# EAGLE design RAMASUK cekiwiw (EAGLE 9.6.2)
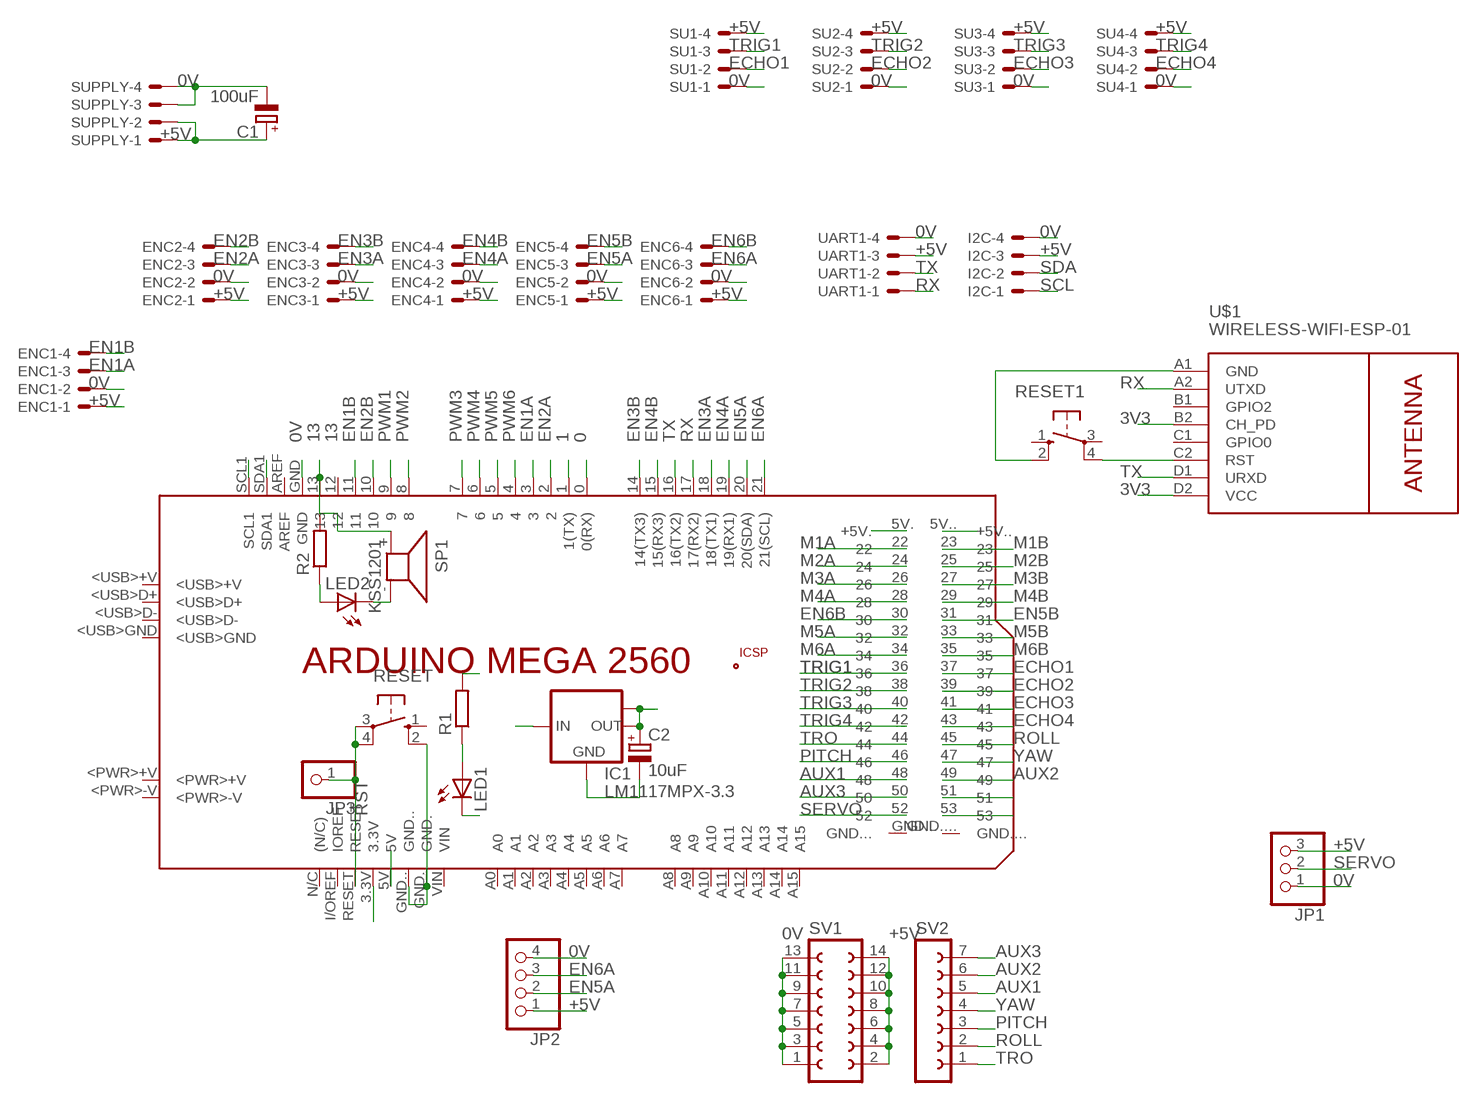
[diagram p0: schematic, sheet 1, part 1 of 2]
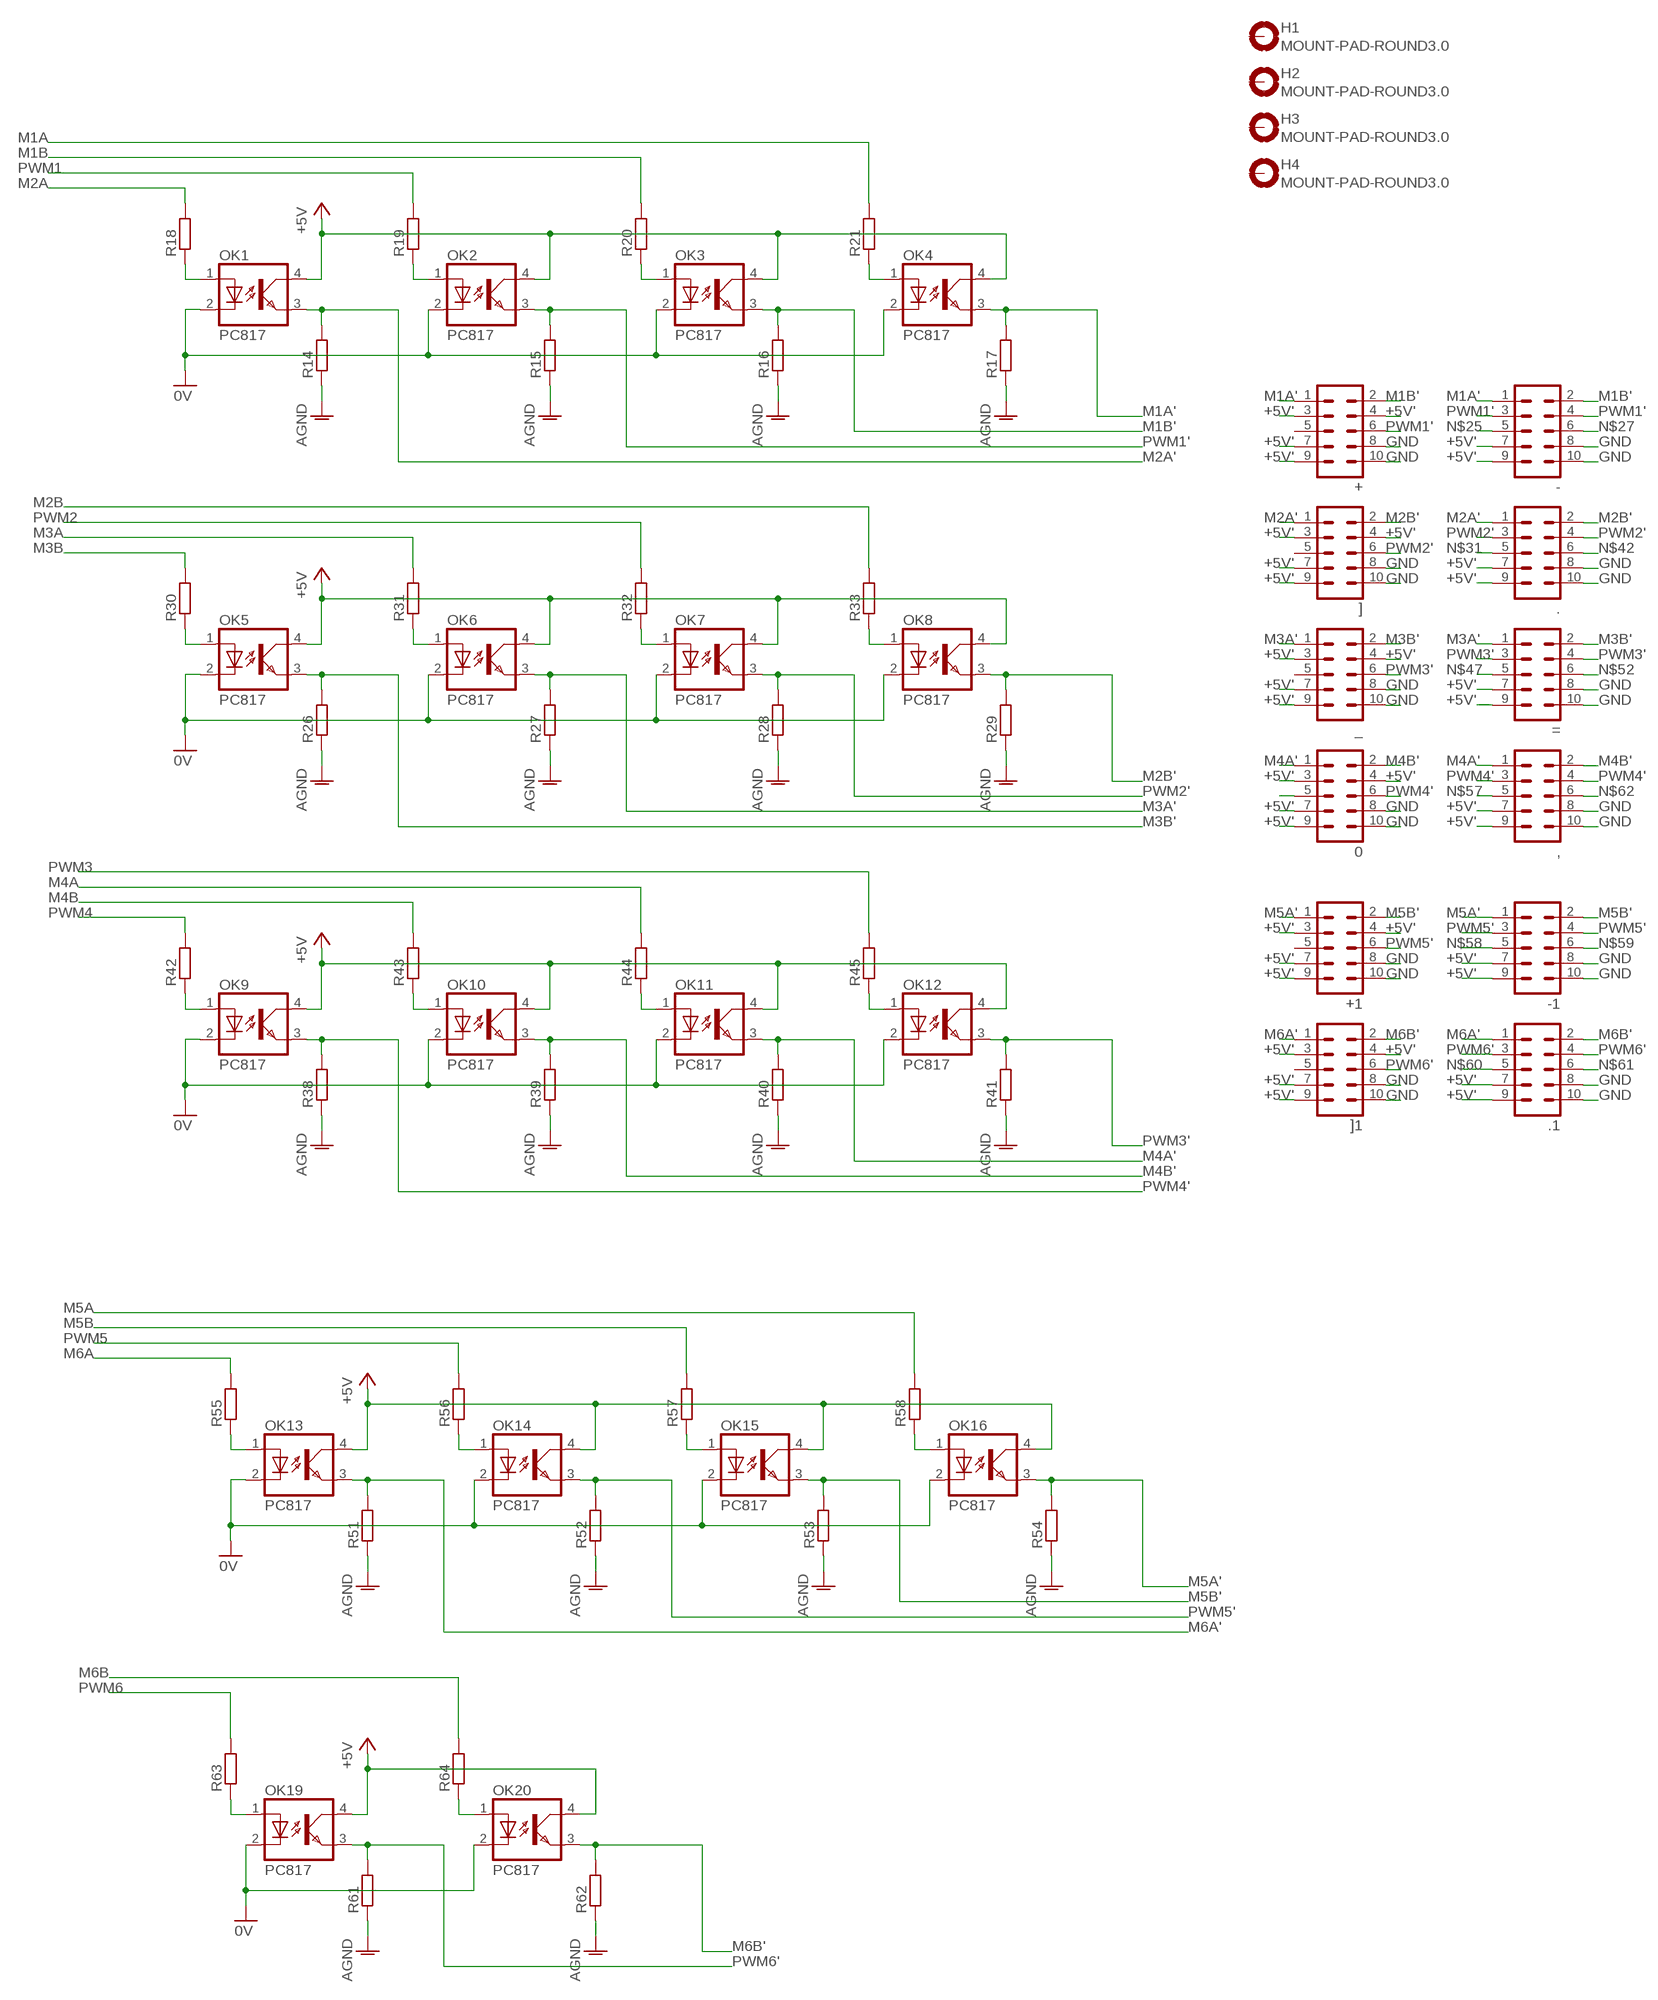
[diagram p1: schematic, sheet 1, part 2 of 2]

## Parts
0  ML10  [ML10]
+  ML10  [ML10]
+1  ML10  [ML10]
,  ML10  [ML10]
-  ML10  [ML10]
-1  ML10  [ML10]
.  ML10  [ML10]
.1  ML10  [ML10]
=  ML10  [ML10]
]  ML10  [ML10]
]1  ML10  [ML10]
_  ML10  [ML10]
C1  100uF  CPOL-EUE2.5-5  [E2,5-5]
C2  10uF  CPOL-EUE2.5-5  [E2,5-5]
ENC1  22-23-2041  [22-23-2041]
ENC2  22-23-2041  [22-23-2041]
ENC3  22-23-2041  [22-23-2041]
ENC4  22-23-2041  [22-23-2041]
ENC5  22-23-2041  [22-23-2041]
ENC6  22-23-2041  [22-23-2041]
H1  MOUNT-PAD-ROUND3.0  [3,0-PAD]
H2  MOUNT-PAD-ROUND3.0  [3,0-PAD]
H3  MOUNT-PAD-ROUND3.0  [3,0-PAD]
H4  MOUNT-PAD-ROUND3.0  [3,0-PAD]
I2C  22-23-2041  [22-23-2041]
IC1  LM1117MPX-3.3  [SOT223]
JP1  PINHD-1X3  [1X03]
JP2  PINHD-1X4  [1X04]
JP3  PINHD-1X1  [1X01]
LED1  LED3MM  [LED3MM]
LED2  LED3MM  [LED3MM]
OK1  PC817  [DIL04]
OK2  PC817  [DIL04]
OK3  PC817  [DIL04]
OK4  PC817  [DIL04]
OK5  PC817  [DIL04]
OK6  PC817  [DIL04]
OK7  PC817  [DIL04]
OK8  PC817  [DIL04]
OK9  PC817  [DIL04]
OK10  PC817  [DIL04]
OK11  PC817  [DIL04]
OK12  PC817  [DIL04]
OK13  PC817  [DIL04]
OK14  PC817  [DIL04]
OK15  PC817  [DIL04]
OK16  PC817  [DIL04]
OK19  PC817  [DIL04]
OK20  PC817  [DIL04]
PCB1  ARDUINO_MEGA2560  [ARDUINO_MEGA2560]
R1  R-EU_M0805  [M0805]
R2  R-EU_M0805  [M0805]
R14  R-EU_M0805  [M0805]
R15  R-EU_M0805  [M0805]
R16  R-EU_M0805  [M0805]
R17  R-EU_M0805  [M0805]
R18  R-EU_M0805  [M0805]
R19  R-EU_M0805  [M0805]
R20  R-EU_M0805  [M0805]
R21  R-EU_M0805  [M0805]
R26  R-EU_M0805  [M0805]
R27  R-EU_M0805  [M0805]
R28  R-EU_M0805  [M0805]
R29  R-EU_M0805  [M0805]
R30  R-EU_M0805  [M0805]
R31  R-EU_M0805  [M0805]
R32  R-EU_M0805  [M0805]
R33  R-EU_M0805  [M0805]
R38  R-EU_M0805  [M0805]
R39  R-EU_M0805  [M0805]
R40  R-EU_M0805  [M0805]
R41  R-EU_M0805  [M0805]
R42  R-EU_M0805  [M0805]
R43  R-EU_M0805  [M0805]
R44  R-EU_M0805  [M0805]
R45  R-EU_M0805  [M0805]
R51  R-EU_M0805  [M0805]
R52  R-EU_M0805  [M0805]
R53  R-EU_M0805  [M0805]
R54  R-EU_M0805  [M0805]
R55  R-EU_M0805  [M0805]
R56  R-EU_M0805  [M0805]
R57  R-EU_M0805  [M0805]
R58  R-EU_M0805  [M0805]
R61  R-EU_M0805  [M0805]
R62  R-EU_M0805  [M0805]
R63  R-EU_M0805  [M0805]
R64  R-EU_M0805  [M0805]
RESET  40-XX  [B3F-40XX]
RESET1  40-XX  [B3F-40XX]
SP1  KSS1201  [KSS1201]
SU1  22-23-2041  [22-23-2041]
SU2  22-23-2041  [22-23-2041]
SU3  22-23-2041  [22-23-2041]
SU4  22-23-2041  [22-23-2041]
SUPPLY  22-23-2041  [22-23-2041]
SV1  FE07-2  [FE07-2]
SV2  FE07-1  [FE07]
U$1  WIRELESS-WIFI-ESP-01  [WIRELESS-WIFI-ESP-01]
UART1  22-23-2041  [22-23-2041]

## Nets
0: PCB1.0(0(RX))
0V: C1.- ENC1.2 ENC2.2 ENC3.2 ENC4.2 ENC5.2 ENC6.2 I2C.4 JP1.1 JP2.4 LED1.K(C) LED2.K(C) OK1.2(C) OK2.2(C) OK3.2(C) OK4.2(C) OK5.2(C) OK6.2(C) OK7.2(C) OK8.2(C) OK9.2(C) OK10.2(C) OK11.2(C) OK12.2(C) OK13.2(C) OK14.2(C) OK15.2(C) OK16.2(C) OK19.2(C) OK20.2(C) PCB1.GND PCB1.GND. PCB1.GND.. RESET.2(S1) SP1.- SU1.1 SU2.1 SU3.1 SU4.1 SUPPLY.3 SUPPLY.4 SV1.1 SV1.3 SV1.5 SV1.7 SV1.9 SV1.11 SV1.13 UART1.4
1: PCB1.1(1(TX))
3V3: C2.+ IC1.2(OUT) IC1.TAB(OUT1) PCB1.3.3V U$1.B2(CH_PD) U$1.D2(VCC)
13: PCB1.13 R2.2 SP1.+
+5V: C1.+ ENC1.1 ENC2.1 ENC3.1 ENC4.1 ENC5.1 ENC6.1 I2C.3 IC1.3(IN) JP1.3 JP2.1 PCB1.5V PCB1.5V.(+5V.) PCB1.5V..(+5V..) R1.2 SU1.4 SU2.4 SU3.4 SU4.4 SUPPLY.1 SUPPLY.2 SV1.2 SV1.4 SV1.6 SV1.8 SV1.10 SV1.12 SV1.14 UART1.3
+5V': 0.3 0.4 0.7 0.9 +1.3 +1.4 +1.7 +1.9 +.3 +.4 +.7 +.9 ,.7 ,.9 -1.7 -1.9 -.7 -.9 .1.7 .1.9 ..7 ..9 =.7 =.9 ]1.3 ]1.4 ]1.7 ]1.9 ].3 ].4 ].7 ].9 _.3 _.4 _.7 _.9 OK1.4(COL) OK2.4(COL) OK3.4(COL) OK4.4(COL) OK5.4(COL) OK6.4(COL) OK7.4(COL) OK8.4(COL) OK9.4(COL) OK10.4(COL) OK11.4(COL) OK12.4(COL) OK13.4(COL) OK14.4(COL) OK15.4(COL) OK16.4(COL) OK19.4(COL) OK20.4(COL) ; supply symbol labelled +5V
AUX1: PCB1.48 SV2.5
AUX2: PCB1.49 SV2.6
AUX3: PCB1.50 SV2.7
ECHO1: PCB1.37 SU1.2
ECHO2: PCB1.39 SU2.2
ECHO3: PCB1.41 SU3.2
ECHO4: PCB1.43 SU4.2
EN1A: ENC1.3 PCB1.3
EN1B: ENC1.4 PCB1.11
EN2A: ENC2.3 PCB1.2
EN2B: ENC2.4 PCB1.10
EN3A: ENC3.3 PCB1.18(18(TX1))
EN3B: ENC3.4 PCB1.14(14(TX3))
EN4A: ENC4.3 PCB1.19(19(RX1))
EN4B: ENC4.4 PCB1.15(15(RX3))
EN5A: ENC5.3 JP2.2 PCB1.20(20(SDA))
EN5B: ENC5.4 PCB1.31
EN6A: ENC6.3 JP2.3 PCB1.21(21(SCL))
EN6B: ENC6.4 PCB1.30
GND: 0.8 0.10 +1.8 +1.10 +.8 +.10 ,.8 ,.10 -1.8 -1.10 -.8 -.10 .1.8 .1.10 ..8 ..10 =.8 =.10 ]1.8 ]1.10 ].8 ].10 _.8 _.10 R14.1 R15.1 R16.1 R17.1 R26.1 R27.1 R28.1 R29.1 R38.1 R39.1 R40.1 R41.1 R51.1 R52.1 R53.1 R54.1 R61.1 R62.1 ; supply symbol labelled AGND
M1A: PCB1.22 R21.2
M1A': +.1 -.1 OK4.3(EMIT) R17.2
M1B: PCB1.23 R20.2
M1B': +.2 -.2 OK3.3(EMIT) R16.2
M2A: PCB1.24 R18.2
M2A': ..1 ].1 OK1.3(EMIT) R14.2
M2B: PCB1.25 R33.2
M2B': ..2 ].2 OK8.3(EMIT) R29.2
M3A: PCB1.26 R31.2
M3A': =.1 _.1 OK6.3(EMIT) R27.2
M3B: PCB1.27 R30.2
M3B': =.2 _.2 OK5.3(EMIT) R26.2
M4A: PCB1.28 R44.2
M4A': 0.1 ,.1 OK11.3(EMIT) R40.2
M4B: PCB1.29 R43.2
M4B': 0.2 ,.2 OK10.3(EMIT) R39.2
M5A: PCB1.32 R58.2
M5A': +1.1 -1.1 OK16.3(EMIT) R54.2
M5B: PCB1.33 R57.2
M5B': +1.2 -1.2 OK15.3(EMIT) R53.2
M6A: PCB1.34 R55.2
M6A': .1.1 ]1.1 OK13.3(EMIT) R51.2
M6B: PCB1.35 R64.2
M6B': .1.2 ]1.2 OK20.3(EMIT) R62.2
N$1: RESET1.2(S1) U$1.A1(GND)
N$3: LED1.A R1.1
N$4: LED2.A R2.1
N$6: C2.- IC1.1(GND)
N$9: OK1.1(A) R18.1
N$10: OK2.1(A) R19.1
N$11: OK3.1(A) R20.1
N$12: OK4.1(A) R21.1
N$13: RESET1.4(P1) U$1.C2(RST)
N$18: OK5.1(A) R30.1
N$19: OK6.1(A) R31.1
N$20: OK7.1(A) R32.1
N$21: OK8.1(A) R33.1
N$24: PCB1.51
N$25: -.5
N$26: PCB1.53
N$27: -.6
N$31: ..5
N$37: OK9.1(A) R42.1
N$38: OK10.1(A) R43.1
N$39: OK11.1(A) R44.1
N$40: OK12.1(A) R45.1
N$42: ..6
N$43: OK13.1(A) R55.1
N$44: OK14.1(A) R56.1
N$45: OK15.1(A) R57.1
N$46: OK16.1(A) R58.1
N$47: =.5
N$50: OK19.1(A) R63.1
N$51: OK20.1(A) R64.1
N$52: =.6
N$57: ,.5
N$58: -1.5
N$59: -1.6
N$60: .1.5
N$61: .1.6
N$62: ,.6
NC4: 0.5
PITCH: PCB1.46 SV2.3
PWM1: PCB1.9 R19.2
PWM1': +.6 -.3 -.4 OK2.3(EMIT) R15.2
PWM2: PCB1.8 R32.2
PWM2': ..3 ..4 ].6 OK7.3(EMIT) R28.2
PWM3: PCB1.7 R45.2
PWM3': =.3 =.4 _.6 OK12.3(EMIT) R41.2
PWM4: PCB1.6 R42.2
PWM4': 0.6 ,.3 ,.4 OK9.3(EMIT) R38.2
PWM5: PCB1.5 R56.2
PWM5': +1.6 -1.3 -1.4 OK14.3(EMIT) R52.2
PWM6: PCB1.4 R63.2
PWM6': .1.3 .1.4 ]1.6 OK19.3(EMIT) R61.2
ROLL: PCB1.45 SV2.2
RST: JP3.1 PCB1.RESET RESET.3(P) RESET.4(P1)
RX: PCB1.17(17(RX2)) U$1.A2(UTXD) UART1.1
SCL: I2C.1 PCB1.SCL1
SDA: I2C.2 PCB1.SDA1
SERVO: JP1.2 PCB1.52
TRIG1: PCB1.36 SU1.3
TRIG2: PCB1.38 SU2.3
TRIG3: PCB1.40 SU3.3
TRIG4: PCB1.42 SU4.3
TRO: PCB1.44 SV2.1
TX: PCB1.16(16(TX2)) U$1.D1(URXD) UART1.2
YAW: PCB1.47 SV2.4
Unconnected: +1.5 +.5 ]1.5 ].5 _.5 H1.B3,0(MOUNT) H2.B3,0(MOUNT) H3.B3,0(MOUNT) H4.B3,0(MOUNT) PCB1.12 PCB1.<PWR>+V PCB1.<PWR>-V PCB1.<USB>+V PCB1.<USB>D+ PCB1.<USB>D- PCB1.<USB>GND PCB1.A0 PCB1.A1 PCB1.A2 PCB1.A3 PCB1.A4 PCB1.A5 PCB1.A6 PCB1.A7 PCB1.A8 PCB1.A9 PCB1.A10 PCB1.A11 PCB1.A12 PCB1.A13 PCB1.A14 PCB1.A15 PCB1.AREF PCB1.GND... PCB1.GND.... PCB1.I/OREF(IOREF) PCB1.N/C((N/C)) PCB1.VIN RESET1.1(S) RESET1.3(P) RESET.1(S) U$1.B1(GPIO2) U$1.C1(GPIO0)

## Library data of the parts
0 + +1 , - -1 . .1 = ] ]1 _ = con-harting-ml:ML10: HARTING; OC_FARNELL: unknown; OC_NEWARK: unknown
C1 C2 = rcl:CPOL-EU: POLARIZED CAPACITOR, European symbol
ENC1-ENC6 I2C SU1-SU4 SUPPLY UART1 = con-molex:22-23-2041: .100" (2.54mm) Center Header - 4 Pin; MF: MOLEX; MPN: 22-23-2041; OC_FARNELL: 1462920; OC_NEWARK: 38C0355
H1-H4 = holes:MOUNT-PAD-ROUND: MOUNTING PAD, round
IC1 = lm1117:LM1117MPX-*
JP1 = adafruit:PINHD-1X3: PIN HEADER
JP2 = pinhead:PINHD-1X4: PIN HEADER
JP3 = pinhead:PINHD-1X1: PIN HEADER
LED1 LED2 = led:LED: LED OSRAM: - CHIPLED LG R971, LG N971, LY N971, LG Q971, LY Q971, LO R971, LY R971 LH N974, LH R974 LS Q976, LO Q976, LY Q976 LO Q996 - Hyper CHIPLED LW Q18S LB Q993, LB Q99A, LB R99A - SideLED LS A670, LO A670, LY A670, LG A670, LP A670 LB A673, LV A673, LT A673, LW A673 LH A674 LY A675 LS A676, LA A676, LO A676, LY A676, LW A676 LS A679, LY A679, LG A679 - Hyper Micro SIDELED® LS Y876, LA Y876, LO Y876, LY Y876 LT Y87S - SmartLED LW L88C, LW L88S LB L89C, LB L89S, LG L890 LS L89K, LO L89K, LY L89K LS L896, LA L896, LO L896, LY L896 - TOPLED LS T670, LO T670, LY T670, LG T670, LP T670 LSG T670, LSP T670, LSY T670, LOP T670, LYG T670 LG T671, LOG T671, LSG T671 LB T673, LV T673, LT T673, LW T673 LH T674 LS T676, LA T676, LO T676, LY T676, LB T676, LH T676, LSB T676, LW T676 LB T67C, LV T67C, LT T67C, LS T67K, LO T67K, LY T67K, LW E67C LS E67B, LA E67B, LO E67B, LY E67B, LB E67C, LV E67C, LT E67C LW T67C LS T679, LY T679, LG T679 LS T770, LO T770, LY T770, LG T770, LP T770 LB T773, LV T773, LT T773, LW T773 LH T774 LS E675, LA E675, LY E675, LS T675 LS T776, LA T776, LO T776, LY T776, LB T776 LHGB T686 LT T68C, LB T68C - Hyper Mini TOPLED® LB M676 - Mini TOPLED Santana® LG M470 LS M47K, LO M47K, LY M47K Source: http://www.osram.convergy.de LUXEON: - LUMILED® LXK2-PW12-R00, LXK2-PW12-S00, LXK2-PW14-U00, LXK2-PW14-V00 LXK2-PM12-R00, LXK2-PM12-S00, LXK2-PM14-U00 LXK2-PE12-Q00, LXK2-PE12-R00, LXK2-PE12-S00, LXK2-PE14-T00, LXK2-PE14-U00 LXK2-PB12-K00, LXK2-PB12-L00, LXK2-PB12-M00, LXK2-PB14-N00, LXK2-PB14-P00, LXK2-PB14-Q00 LXK2-PR12-L00, LXK2-PR12-M00, LXK2-PR14-Q00, LXK2-PR14-R00 LXK2-PD12-Q00, LXK2-PD12-R00, LXK2-PD12-S00 LXK2-PH12-R00, LXK2-PH12-S00 LXK2-PL12-P00, LXK2-PL12-Q00, LXK2-PL12-R00 Source: www.luxeon.com KINGBRIGHT: KA-3528ASYC Source: www.kingbright.com
OK1-OK16 OK19 OK20 = optocoupler:PC817: SHARP OPTO COUPLER; MPN: PC817X4J000F; OC_FARNELL: 9707727; OC_NEWARK: 97K7059
PCB1 = Arduino:ARDUINO_MEGA2560: Device for representing an Arduino Mega 2560 board with a footprint in an EAGLE design. Created by Dave Young for Element14. More EAGLE documentation at: http://www.element14.com/community/community/knode/cadsoft_eagle
R1 R2 R14-R21 R26-R33 R38-R45 R51-R58 R61-R64 = rcl:R-EU_: RESISTOR, European symbol
RESET RESET1 = switch-omron:40-XX: OMRON SWITCH; MF: OMRON COMPONENTS USA; MPN: B3F-4000; OC_FARNELL: 176434; OC_NEWARK: 36K3105
SP1 = buzzer:KSS1201: SPEAKER Source: Schukat; OC_FARNELL: unknown; OC_NEWARK: unknown
SV1 = con-lsta:FE07-2: FEMALE HEADER; OC_FARNELL: unknown; OC_NEWARK: unknown
SV2 = con-lsta:FE07-1: FEMALE HEADER; OC_FARNELL: unknown; OC_NEWARK: unknown
U$1 = ESP-01:WIRELESS-WIFI-ESP-01: Wireless Wi-Fi ESP-01 Module based on ESP8266 chip Click here to find device on ebay.com <http://www.ebay.com/sch/esp8266+esp+01+transceiver>

## Board
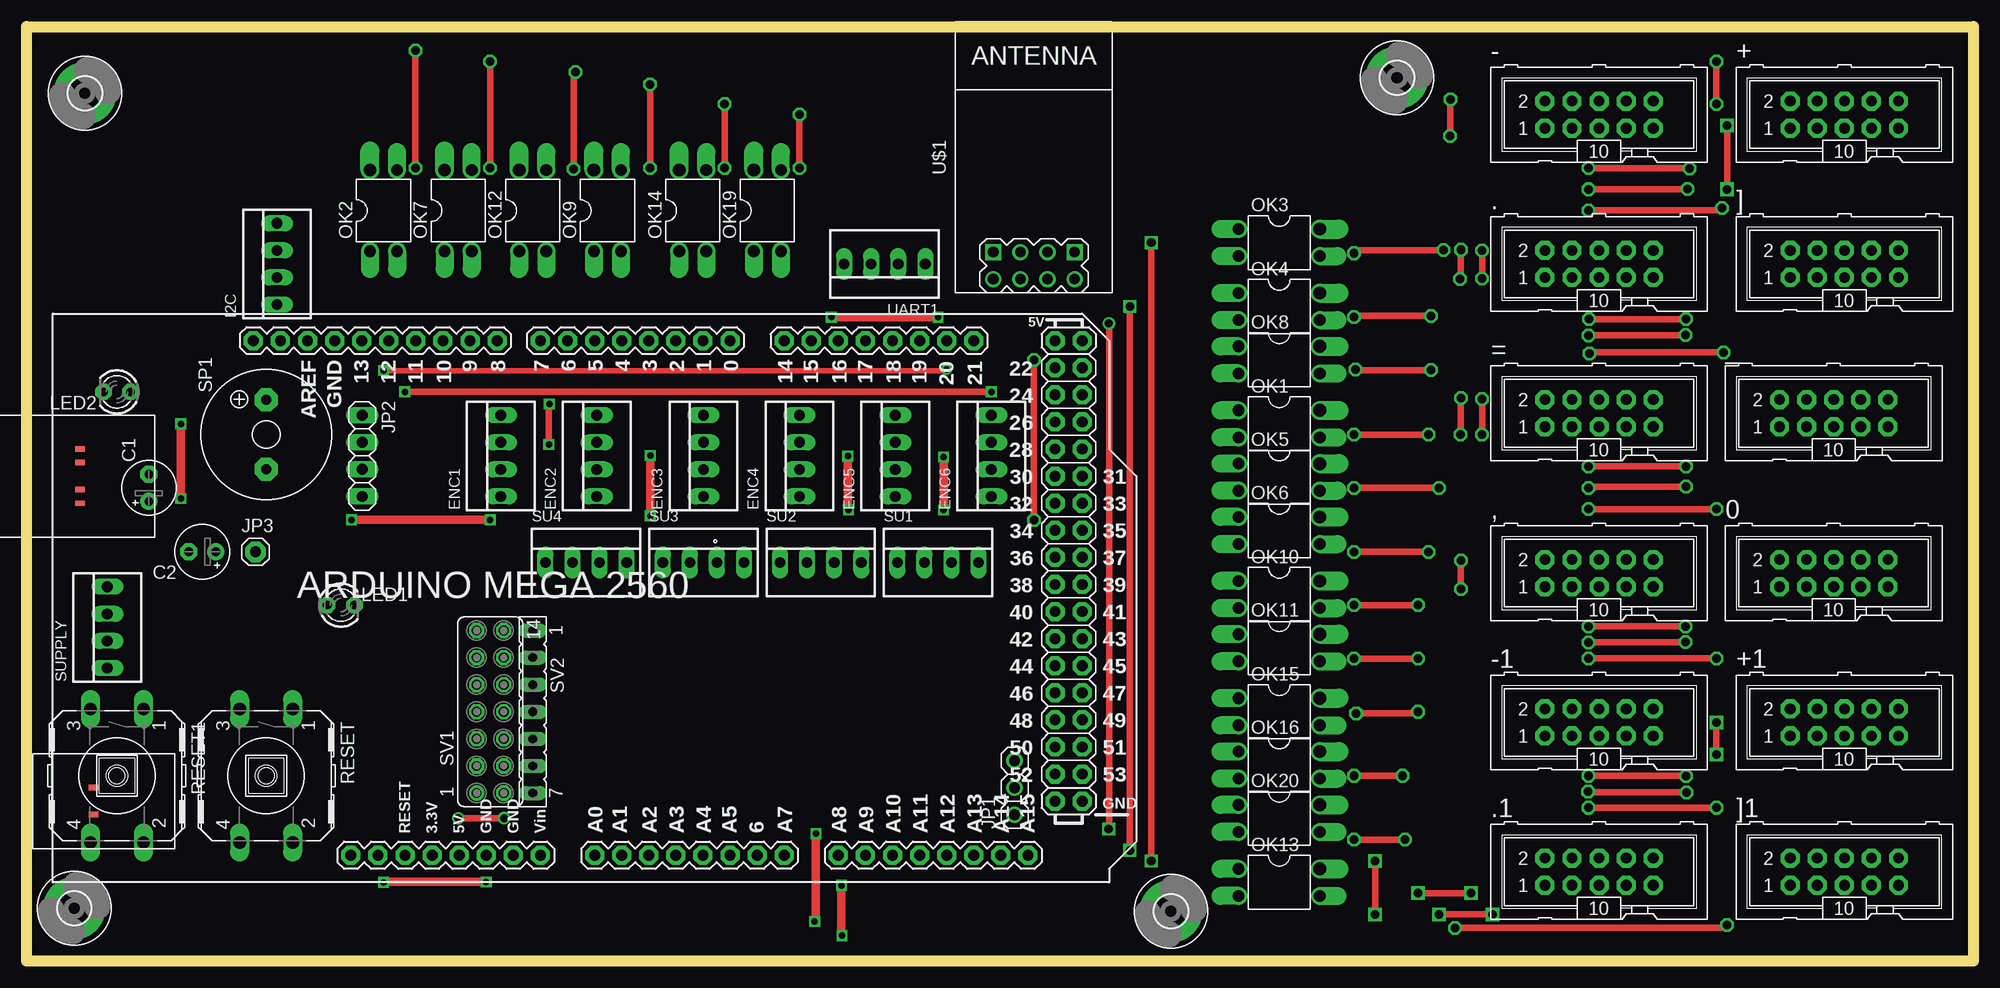
[diagram p2: board, top side]
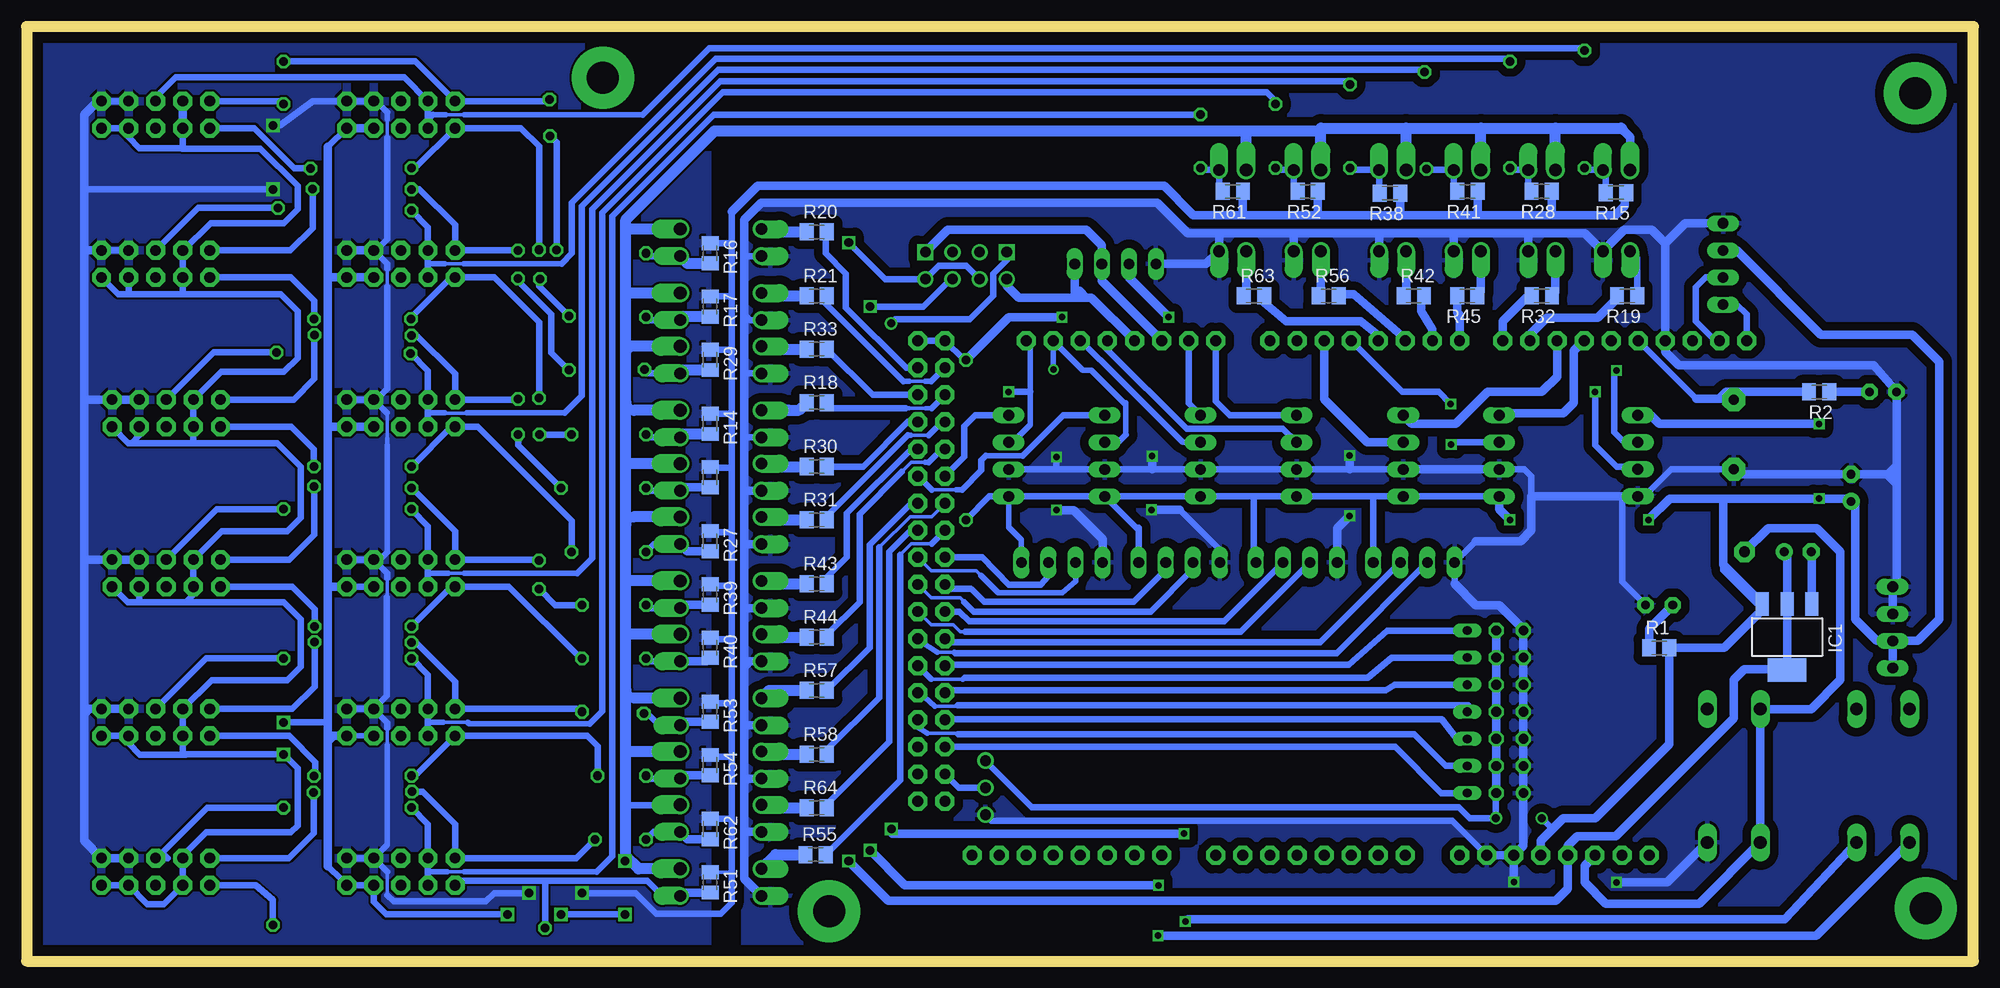
[diagram p3: board, bottom side, seen from below]

Size 182.56 x 87.63 mm. Coordinates in mm from the lower left corner, seen from the top.
Outline: 0,87.63 182.56,87.63 182.56,0 0,0 0,87.63
Copper layers (1*16): Top 0.035mm / dielectric 1.5mm / Bottom 0.035mm
Design rules "default": minimum track width 10mil, minimum drill 24mil, track to track 8mil, track to pad 8mil, pad to pad 8mil, via to via 8mil, smd to smd 8mil, copper to edge 40mil, drill to drill 8mil, minimum pad ring 10mil, minimum via ring 8mil, stop-mask expansion 4mil, vias tented up to drill 0mil, thermal gap 10mil

### Footprints (pad centres in the part's own frame; a part is rotated, then mirrored left to right if it is on the bottom)
ML10 = drill 1 pad 1.778 octagon: 1 -5.08,-1.27; 2 -5.08,1.27; 3 -2.54,-1.27; 4 -2.54,1.27; 5 0,-1.27; 6 0,1.27; 7 2.54,-1.27; 8 2.54,1.27; 9 5.08,-1.27; 10 5.08,1.27
E2,5-5 = drill 0.813 pad 1.6: + -1.27,0 | drill 0.813 pad 1.6 octagon: - 1.27,0
22-23-2041 = drill 1 long: 1 -3.81,0; 2 -1.27,0; 3 1.27,0; 4 3.81,0
3,0-PAD = drill 3 pad 5.842: B3,0 0,0
SOT223 = smd 1.219 x 2.235: 1 -2.311,-3.099; 2 0,-3.099; 3 2.311,-3.099 | smd 3.6 x 2.2: TAB 0,3.099
1X03 = drill 1.016: 1 -2.54,0; 2 0,0; 3 2.54,0
1X04 = drill 1.016 long: 1 -3.81,0; 2 -1.27,0; 3 1.27,0; 4 3.81,0
1X01 = drill 1 pad 1.93 octagon: 1 0,0
LED3MM = drill 0.813 pad 1.524 octagon: A -1.27,0; K 1.27,0
DIL04 = drill 1.1 pad 1.676 offset: 1 -1.27,-3.81; 2 1.27,-3.81; 3 1.27,3.81 | drill 1.2 pad 1.676 offset: 4 -1.27,3.81
ARDUINO_MEGA2560 = drill 1.016 pad 1.778 octagon: 0 63.5,50.8; 1 60.96,50.8; 2 58.42,50.8; 3 55.88,50.8; 3.3V 35.56,2.54; 4 53.34,50.8; 5 50.8,50.8; 5V 38.1,2.54; 5V. 93.98,50.8; 5V.. 96.52,50.8; 6 48.26,50.8; 7 45.72,50.8; 8 41.656,50.8; 9 39.116,50.8; 10 36.576,50.8; 11 34.036,50.8; 12 31.496,50.8; 13 28.956,50.8; 14 68.58,50.8; 15 71.12,50.8; 16 73.66,50.8; 17 76.2,50.8; 18 78.74,50.8; 19 81.28,50.8; 20 83.82,50.8; 21 86.36,50.8; 22 93.98,48.26; 23 96.52,48.26; 24 93.98,45.72; 25 96.52,45.72; 26 93.98,43.18; 27 96.52,43.18; 28 93.98,40.64; 29 96.52,40.64; 30 93.98,38.1; 31 96.52,38.1; 32 93.98,35.56; 33 96.52,35.56; 34 93.98,33.02; 35 96.52,33.02; 36 93.98,30.48; 37 96.52,30.48; 38 93.98,27.94; 39 96.52,27.94; 40 93.98,25.4; 41 96.52,25.4; 42 93.98,22.86; 43 96.52,22.86; 44 93.98,20.32; 45 96.52,20.32; 46 93.98,17.78; 47 96.52,17.78; 48 93.98,15.24; 49 96.52,15.24; 50 93.98,12.7; 51 96.52,12.7; 52 93.98,10.16; 53 96.52,10.16; A0 50.8,2.54; A1 53.34,2.54; A2 55.88,2.54; A3 58.42,2.54; A4 60.96,2.54; A5 63.5,2.54; A6 66.04,2.54; A7 68.58,2.54; A8 73.66,2.54; A9 76.2,2.54; A10 78.74,2.54; A11 81.28,2.54; A12 83.82,2.54; A13 86.36,2.54; A14 88.9,2.54; A15 91.44,2.54; AREF 23.876,50.8; GND 26.416,50.8; GND. 43.18,2.54; GND.. 40.64,2.54; GND... 93.98,7.62; GND.... 96.52,7.62; I/OREF 30.48,2.54; N/C 27.94,2.54; RESET 33.02,2.54; SCL1 18.796,50.8; SDA1 21.336,50.8; VIN 45.72,2.54 | smd 1.016 x 0.508: <PWR>+V 3.81,8.89; <PWR>-V 3.81,6.35; <USB>+V 2.54,40.64; <USB>D+ 2.54,39.37; <USB>D- 2.54,36.83; <USB>GND 2.54,35.56
M0805 = smd 1.3 x 1.6: 1 -0.95,0; 2 0.95,0
B3F-40XX = drill 1.194 long: 1 -6.248,2.489; 2 6.248,2.489; 3 -6.248,-2.489; 4 6.248,-2.489
KSS1201 = drill 0.914 pad 2.159 octagon: + 3.251,0; - -3.251,0
FE07-2 = drill 0.914: 1 -7.62,1.27 | drill 0.914 octagon: 2 -7.62,-1.27; 3 -5.08,1.27; 4 -5.08,-1.27; 5 -2.54,1.27; 6 -2.54,-1.27; 7 0,1.27; 8 0,-1.27; 9 2.54,1.27; 10 2.54,-1.27; 11 5.08,1.27; 12 5.08,-1.27; 13 7.62,1.27; 14 7.62,-1.27
FE07 = drill 0.813 long: 1 -7.62,0; 2 -5.08,0; 3 -2.54,0; 4 0,0; 5 2.54,0; 6 5.08,0; 7 7.62,0
WIRELESS-WIFI-ESP-01 = drill 1 square: A1 -8.89,3.81; D1 -8.89,-3.81 | drill 1: A2 -11.43,3.81; B1 -8.89,1.27; B2 -11.43,1.27; C1 -8.89,-1.27; C2 -11.43,-1.27; D2 -11.43,-3.81

### Placement (x,y rotation side)
0  169.47,36.38 0 top
+  170.47,79.38 0 top
+1  170.47,22.38 0 top
,  147.47,36.38 0 top
-  147.47,79.38 0 top
-1  147.47,22.38 0 top
.  147.47,65.38 0 top
.1  147.47,8.38 0 top
=  147.47,51.38 0 top
]  170.47,65.38 0 top
]1  170.47,8.38 0 top
_  169.47,51.38 0 top
C1  11.47,44.38 90 top
C2  16.47,38.38 180 top
ENC1  44.47,47.38 90 top
ENC2  53.47,47.38 90 top
ENC3  63.47,47.38 90 top
ENC4  72.47,47.38 90 top
ENC5  81.47,47.38 90 top
ENC6  90.47,47.38 90 top
H1  5.47,81.38 180 top
H2  128.51,82.84 0 top
H3  107.31,4.67 0 top
H4  4.47,4.95 0 top
I2C  23.47,65.38 90 top
IC1  17.47,30.38 180 bottom
JP1  92.65,16.26 90 top
JP2  31.47,47.38 270 top
JP3  21.47,38.38 0 top
LED1  29.47,33.38 0 top
LED2  8.47,53.38 180 top
OK1  117.47,50.38 270 top
OK2  33.47,70.38 0 top
OK3  117.47,67.38 270 top
OK4  117.47,61.38 270 top
OK5  117.47,45.38 270 top
OK6  117.47,40.38 270 top
OK7  40.47,70.38 0 top
OK8  117.47,56.38 270 top
OK9  54.47,70.38 0 top
OK10  117.47,34.38 270 top
OK11  117.47,29.38 270 top
OK12  47.47,70.38 0 top
OK13  117.47,7.38 270 top
OK14  62.47,70.38 0 top
OK15  117.47,23.38 270 top
OK16  117.47,18.38 270 top
OK19  69.47,70.38 0 top
OK20  117.47,13.38 270 top
PCB1  2.47,7.38 0 top
R1  29.47,29.38 0 bottom
R2  14.47,53.38 180 bottom
R14  118.47,50.38 270 bottom
R15  33.51,72.06 180 bottom
R16  118.47,66.38 270 bottom
R17  118.47,61.38 270 bottom
R18  108.47,52.38 0 bottom
R19  32.47,62.38 180 bottom
R20  108.47,68.38 0 bottom
R21  108.47,62.38 0 bottom
R26  118.47,45.38 270 bottom
R27  118.47,39.38 270 bottom
R28  40.49,72.2 180 bottom
R29  118.47,56.38 270 bottom
R30  108.47,46.38 0 bottom
R31  108.47,41.38 0 bottom
R32  40.47,62.38 180 bottom
R33  108.47,57.38 0 bottom
R38  54.71,72.01 180 bottom
R39  118.47,34.38 270 bottom
R40  118.47,29.38 270 bottom
R41  47.44,72.18 180 bottom
R42  52.47,62.38 0 bottom
R43  108.47,35.38 0 bottom
R44  108.47,30.38 0 bottom
R45  47.47,62.38 180 bottom
R51  118.47,7.38 270 bottom
R52  62.42,72.18 180 bottom
R53  118.47,23.38 270 bottom
R54  118.47,18.38 270 bottom
R55  108.57,9.99 0 bottom
R56  60.47,62.38 0 bottom
R57  108.47,25.38 0 bottom
R58  108.47,19.38 0 bottom
R61  69.44,72.18 180 bottom
R62  118.47,12.38 270 bottom
R63  67.47,62.38 0 bottom
R64  108.47,14.38 0 bottom
RESET  22.47,17.38 270 top
RESET1  8.47,17.38 270 top
SP1  22.47,49.38 90 top
SU1  85.47,37.38 0 top
SU2  74.47,37.38 0 top
SU3  63.47,37.38 0 top
SU4  52.47,37.38 0 top
SUPPLY  7.56,31.29 90 top
SV1  43.47,23.38 90 top
SV2  47.47,23.38 270 top
U$1  94.47,75.38 90 top
UART1  80.47,65.38 180 top

### Tracks (layer width: path | path; a pad name or v marks a point on that pad's centre or on a via)
0V  (via drill 0.61)
  Top 0.813: v77.07,42.32 77.01,42.38 v77.01,47.35 | v85.98,47.27 v85.98,42.3 | v58.49,47.42 v58.49,41.75 | v33.47,7.38 33.51,7.42 v43.1,7.42
  Bottom 0.61: ENC6.2 85.98,46.11 | 85.98,46.11 ENC5.2 77.01,46.11 ENC4.2 ENC3.2 58.49,46.11 ENC2.2 | OK1.2 115.25,49.11 | OK8.2 115.25,55.11 | OK4.2 114.72,60.11 115.25,60.64 | OK3.2 115.25,66.11 | 41.47,43.57 41.48,43.58 41.48,45.46 42.12,46.11 ENC1.2 | LED1.K 32.93,35.58 32.93,43.57 | SP1.- 28.31,46.13 30.87,43.57 JP2.4 | 85.98,46.11 v85.98,47.27 | 46.66,39.38 SU4.1 48.66,35.38 | SU2.1 70.66,38.57 74.41,42.32 | JP1.1 92.08,13.15 48.88,13.15 PCB1.GND.
  Bottom 0.813: 41.74,68.26 36.43,68.26 OK2.2 32.73,68.58 30.16,68.58 28.89,67.31 | 41.74,68.26 48.74,68.26 | 48.74,68.26 55.74,68.26 | 55.74,68.26 63.74,68.26 | 63.74,68.26 70.74,68.26 | 115.25,44.11 115.25,49.11 115.25,55.11 115.25,60.64 115.25,66.11 115.25,69.53 113.66,71.12 76.52,71.12 73.66,68.26 70.74,68.26 | 115.25,44.11 115.25,39.11 | 115.25,39.11 115.25,33.11 | 115.25,33.11 115.25,27.62 | 115.25,27.62 115.25,22.11 | 115.25,22.11 115.25,16.83 | 115.25,16.83 115.25,12.11 | 115.25,12.11 115.25,7.71 OK13.2 | OK20.2 115.25,12.11 | OK16.2 114.97,17.11 115.25,16.83 | OK15.2 115.25,22.11 | OK11.2 114.77,28.11 115.25,27.62 | OK10.2 115.25,33.11 | OK6.2 115.25,39.11 | OK5.2 115.25,44.11 | 70.74,68.26 OK19.2 71.93,65.38 UART1.4 | OK14.2 63.74,68.26 | OK9.2 55.74,68.26 | OK12.2 48.74,68.26 | OK7.2 41.74,68.26 | 28.89,67.31 28.89,58.19 PCB1.GND 28.88,57.14 27.62,55.88 9.34,55.88 LED2.K 7.2,46.46 | I2C.4 27.01,69.19 28.89,67.31 | ENC2.2 ENC1.2 | v77.07,42.32 74.41,42.32 | v77.01,47.35 77.01,46.11 | SU1.1 81.66,39.57 84.38,42.3 v85.98,42.3 | SU3.1 59.66,40.58 v58.49,41.75 | v58.49,47.42 58.49,46.11 | RESET.2 28.71,7.38 v33.47,7.38 | 46.66,39.38 42.47,39.38 41.47,40.38 41.47,43.57 32.93,43.57 JP2.4 | 48.66,35.38 46.66,33.38 44.47,33.38 42.19,31.11 SV1.13 SV1.11 SV1.9 SV1.7 SV1.5 SV1.3 SV1.1 42.19,10.83 PCB1.GND.. | PCB1.GND.. PCB1.GND. | v43.1,7.42 v43.1,7.43 PCB1.GND.. | 7.2,46.46 7.2,45.64 | 7.2,45.64 7.2,44.78 | 8,45.65 7.21,45.65 7.2,45.64 | 7.2,46.46 8,45.65 | 8,45.65 8.06,45.65 | 8.06,45.65 7.2,44.78 | SP1.- 21.99,45.65 C1.- 8.06,45.65 | 7.2,44.78 7.2,35.47 SUPPLY.4 SUPPLY.3
  pour Bottom (isolate 0.8): -1.13,88.68 115.06,88.68 115.37,-1.02 -1.13,-0.92
3V3  (via drill 0.8)
  Top 0.61: v105.47,67.38 v105.47,9.38
  Bottom 0.61: v105.47,67.38 102.03,63.95 U$1.D2 97.01,65.21 94.46,65.21 U$1.B2 | IC1.TAB 17.56,27.38 17.57,27.38
  Bottom 0.813: IC1.TAB IC1.2 17.47,38.11 C2.+ | 17.57,27.38 21.47,27.38 22.47,26.38 22.47,22.77 33.52,11.72 37.12,11.72 38.03,10.82 PCB1.3.3V 38.03,6.8 39.16,5.67 101.75,5.67 v105.47,9.38
13
  Bottom 0.61: 25.96,52.72 PCB1.13
  Bottom 0.813: R2.2 23.15,53.38 23.81,52.72 | SP1.+ 22.37,52.72 23.81,52.72 | 23.81,52.72 25.96,52.72
+5V  (via drill 0.61, 0.75, 0.8 pad 1.27)
  Top 0.61: v94.47,56.38 v94.47,41.38 | v44.78,13.42 44.75,13.39 v40.48,13.39
  Top 0.813: v43.47,41.38 v30.47,41.38 | v85.47,60.38 v75.47,60.38 | v14.47,50.38 v14.47,43.38
  Bottom 0.508: ENC6.1 90.47,40.7 89.28,39.51 SU1.4
  Bottom 0.61: v94.47,41.38 92.28,43.57 ENC6.1 ENC5.1 | v94.47,56.38 94.65,56.38 PCB1.5V. PCB1.5V.. | ENC5.1 ENC4.1 67.47,43.57 | 67.47,43.57 ENC3.1 | ENC3.1 56.28,43.57 SU4.4 | ENC3.1 ENC2.1 ENC1.1 | SU2.4 78.28,40.62 78.52,40.62 ENC5.1 | 67.47,43.57 67.47,37.38 SU3.4 | SV1.2 44.78,15.72 v44.78,13.42 47.24,13.42 48.26,14.44 88.28,14.44 JP1.3 | v40.48,13.39 39.5,12.41 39.5,12.35 | 23.37,29.38 19.78,32.97 | 19.78,32.97 IC1.3 | 23.47,37.38 23.47,36.66 19.78,32.97
  Bottom 0.813: I2C.3 22.2,66.65 14.29,58.74 5.72,58.74 3.17,56.2 3.17,32.07 5.22,30.02 SUPPLY.2 | PCB1.5V 40.56,11.28 39.5,12.35 38.47,13.38 35.47,13.38 28.52,20.33 R1.2 23.37,29.38 20.03,32.72 20.03,33.73 | ENC1.1 44.47,42.38 v43.47,41.38 | v94.47,56.38 90.47,60.38 v85.47,60.38 | UART1.3 79.19,64.11 v75.47,60.38 | 23.47,43.38 28.47,43.38 v30.47,41.38 | 23.47,43.38 23.47,37.38 23.47,37.17 20.03,33.73 | JP2.1 30.28,51.19 29.47,50.38 v14.47,50.38 | 23.47,43.38 v14.47,43.38 11.73,43.38 C1.+ 11.1,42.74 11.1,32.05 9.07,30.02 SUPPLY.2 | SV1.2 SV1.4 SV1.6 SV1.8 SV1.10 SV1.12 SV1.14 | IC1.3 20.03,33.73 | SUPPLY.1 SUPPLY.2
+5V'  (via drill 0.8 pad 1.27)
  Top 0.61: v137.47,4.38 v132.47,4.38 | v126.47,9.38 v126.47,4.38 | v158.47,22.38 v158.47,19.38
  Bottom 0.51: -1.9 -1.7 | 152.55,7.62 .1.9
  Bottom 0.61: 126.37,9.84 126.37,14.29 126.05,14.61 121.32,14.61 OK20.4 | 126.05,19.68 126.37,20 126.37,9.48 v126.47,9.38 | 125.62,24.65 126.37,25.4 | 125.67,41.65 126.37,40.96 | 125.63,51.65 126.37,52.39 | 125.87,57.65 126.37,57.15 | ,.9 ,.7 | -.9 154.31,76.35 | 167.92,19.37 167.64,19.37 167.63,19.38 v158.47,19.38 157.16,18.08 157.16,12.7 157.8,12.06 165.74,12.06 167.92,9.88 ]1.4 ]1.3 169.7,5.33 171.23,5.33 ]1.7 ]1.9 | 167.92,19.37 +1.3 +1.4 165.22,26.35 158.12,26.35 156.84,27.62 156.84,32.07 158.43,33.66 167.64,33.66 | 167.64,33.66 172.01,33.66 | 172.01,33.66 173.09,33.66 0.9 | 0.7 172.01,33.66 | 167.64,33.66 166.92,34.37 0.3 0.4 164.25,40.32 158.12,40.32 156.84,41.59 156.84,46.36 159.07,48.58 166.92,48.58 | 166.92,48.58 172.72,48.58 | 172.72,48.58 173.01,48.58 _.9 | _.7 172.01,49.29 172.72,48.58 | 166.92,48.58 _.3 _.4 164.33,55.25 158.43,55.25 157.16,56.52 157.16,60.96 158.75,62.55 167.92,62.55 | 167.92,62.55 173.01,62.55 | ].9 173.98,62.55 173.01,62.55 | ].7 173.01,62.55 | 167.92,62.55 ].3 ].4 167.86,66.65 165.29,69.21 158.43,69.21 157.16,70.48 157.16,72.71 160.66,76.2 167.96,76.2 167.92,76.23 | +.3 167.92,76.23 | v137.47,4.38 148.84,4.38 150,5.54 .1.7 .1.9 | v132.47,4.38 v126.47,4.38 | 152.55,7.62 153.03,7.62 154.31,8.89 | v158.47,22.38 154.31,22.38 | 167.92,76.23 167.94,76.24 172,76.24 173.01,77.25 +.7 +.9 | 167.92,19.37 171.94,19.37 173.01,20.44 +1.7 +1.9
  Bottom 0.813: 154.31,76.35 154.31,64.11 | 154.31,64.11 154.31,50.11 | 154.31,50.11 154.31,35.11 | 154.31,35.11 154.31,22.38 154.31,20.64 | 154.31,20.64 154.31,8.89 | ..7 ..9 154.31,64.11 | =.7 =.9 154.31,50.11 | ,.9 154.31,35.11 | -1.9 153.83,21.11 154.31,20.64 | -.7 -.9 | +.4 +.3 | OK2.4 32.2,77.28 33.02,78.1
  Bottom 1.016: OK13.4 125.17,8.65 126.37,9.84 126.37,19.37 | 126.37,19.37 126.37,20 126.37,25.4 126.37,30.65 | 126.37,30.65 126.37,35.56 | 126.37,35.56 126.37,40.96 126.37,46.99 | 126.37,46.99 126.37,52.39 126.37,57.15 126.37,62.65 | 126.37,62.65 126.37,68.65 | 126.37,68.65 126.37,69.53 118.05,77.85 68.19,77.85 | 68.19,77.85 61.19,77.85 | 53.19,78.1 61.19,78.1 61.19,77.85 | 53.19,78.1 46.19,78.1 | 46.19,78.1 39.19,78.1 | 39.19,78.1 33.02,78.1 32.96,78.04 | OK7.4 39.19,78.1 | OK12.4 46.19,78.1 | OK9.4 53.19,78.1 | OK14.4 61.19,77.85 | OK19.4 68.19,77.85 | OK3.4 126.37,68.65 | OK4.4 126.37,62.65 | OK8.4 125.87,57.65 | OK1.4 125.63,51.65 | OK16.4 126.08,19.65 | 126.05,19.68 126.08,19.65 | 126.08,19.65 126.37,19.37 | OK15.4 125.62,24.65 | OK11.4 126.37,30.65 | OK10.4 126.28,35.65 126.37,35.56 | OK6.4 125.67,41.65 | OK5.4 126.03,46.65 126.37,46.99
AUX1
  Bottom 0.508: PCB1.48 96.44,22.24 96.47,22.68
  Bottom 0.61: SV2.5 48.47,20.84 49.85,22.68 96.47,22.68
AUX2
  Bottom 0.305: 98.12,21.36 95.28,21.36
  Bottom 0.406: 95.19,21.26 95.28,21.36
  Bottom 0.508: 98.12,21.36 98.99,21.93 PCB1.49
  Bottom 0.61: SV2.6 49.47,18.3 52.43,21.26 95.19,21.26
AUX3
  Bottom 0.61: PCB1.50 54.22,20.08 49.9,15.76 SV2.7
ECHO1
  Bottom 0.305: PCB1.37 97.74,36.62 93.5,36.62 93.06,36.18
  Bottom 0.508: SU1.2 84.19,35.63 85.47,34.53 91.47,34.53 93.06,36.18
ECHO2
  Bottom 0.305: 94.63,33.67 95.01,34.05 97.72,34.05 PCB1.39
  Bottom 0.61: SU2.2 73.19,36.75 77.16,32.78 93.74,32.78 94.63,33.67
ECHO3
  Bottom 0.305: 94.56,30.9 95.01,30.9 95.65,31.53 97.74,31.53 PCB1.41
  Bottom 0.61: SU3.2 68.69,30.88 68.71,30.9 94.56,30.9
ECHO4
  Bottom 0.305: 97.17,28.96 95.55,28.96
  Bottom 0.508: 97.17,28.96 98.75,30.01 PCB1.43 | 95.55,28.96 95.47,28.88
  Bottom 0.61: SU4.2 59.69,28.88 95.47,28.88
EN1A  (via drill 0.61)
  Top 0.61: v49.01,52.24 48.98,52.21 v48.98,48.45
  Bottom 0.61: ENC1.3 48.78,48.65 v48.98,48.45 | v49.01,52.24 50.15,53.38 53.55,53.38 PCB1.3
EN1B
  Bottom 0.61: 44.28,51.38 ENC1.4
  Bottom 0.813: PCB1.11 37.47,57.22 37.47,52.38 38.47,51.38 44.28,51.38
EN2A
  Bottom 0.813: ENC2.3 56.83,48.65 60.88,52.7 PCB1.2
EN2B
  Bottom 0.813: PCB1.10 39.04,54.82 40.48,53.38 45.54,53.38 48.54,50.38 52.66,50.38 ENC2.4
EN3A
  Bottom 0.61: ENC3.3 64.74,49.93 73.79,49.93 81.21,57.35 PCB1.18
EN3B
  Bottom 0.61: PCB1.14 71.05,52.49 69.75,51.19 ENC3.4
EN4A
  Bottom 0.508: ENC4.3 74.16,48.65 81.89,56.38 81.91,56.38 83.71,58.18 PCB1.19
EN4B
  Bottom 0.61: ENC4.4 73.59,52.31 PCB1.15
EN5A  (via drill 0.61)
  Top 0.508: v33.47,55.38 86.17,55.38 v86.26,55.47 | v86.26,55.47
  Bottom 0.508: 79.47,49.38 79.47,52.16 | 79.47,52.16 79.47,52.38 | 79.47,52.16 82.72,55.41 83.52,55.41 PCB1.20 86.28,55.49 v86.26,55.47
  Bottom 0.61: ENC5.3 80.19,48.65 79.47,49.38 | JP2.2 32.73,48.65 33.68,49.59 33.68,55.17 v33.47,55.38
EN5B
  Bottom 0.33: 95.37,44.21 97.66,44.21
  Bottom 0.508: 94.83,44.21 95.37,44.21 | 92.62,47.4 89.13,47.4
  Bottom 0.61: PCB1.31 98.93,45.48 97.66,44.21 | 94.83,44.21 93.03,46.01 93.03,46.99 92.62,47.4 | 89.13,47.4 85.34,51.19 ENC5.4
EN6A  (via drill 0.61)
  Top 0.61: v35.47,53.38 v90.47,53.38
  Bottom 0.508: PCB1.21 88.83,57.74 88.47,57.38 88.47,53.38 88.47,50.28 90.1,48.65
  Bottom 0.61: 90.1,48.65 ENC6.3 | JP2.3 31.73,46.38 33.47,46.38 35.47,48.38 v35.47,53.38 | v90.47,53.38 88.47,53.38
EN6B
  Bottom 0.61: PCB1.30 94.62,47.31 94.62,50.16 93.59,51.19 ENC6.4
GND  (via drill 0.8 pad 1.27)
  Top 0.61: v159.47,78.38 v159.47,72.38 | v135.47,6.38 v130.47,6.38
  Bottom 0.33: 148.78,21.88 148.72,21.83 148.72,20.24 148.78,20.19 | 148.74,49.99 148.74,49.02 | 148.78,63.21 148.74,63.25 148.74,64.94 148.78,64.98 | 148.75,78.96 148.73,78.94 148.73,77.2 148.75,77.18 | 148.73,6.18 148.73,8.38 | 148.74,50.28 148.74,51.39 148.78,51.42 | R51.1 116.51,8.33 116.43,8.41
  Bottom 0.34: 148.8,35.97 148.73,35.9 148.73,34.15 148.77,34.11 148.8,34.08 | 148.74,49.99 148.74,50.28
  Bottom 0.406: 148.77,48.38 148.77,48.99 148.74,49.02
  Bottom 0.508: .1.8 148.72,10.93 148.72,20.24
  Bottom 0.51: 148.75,79.59 148.75,78.96 | 148.77,38.35 148.77,48.38
  Bottom 0.61: .1.10 .1.8 148.73,8.38 | -1.8 -1.10 | ,.8 ,.10 | =.10 =.8 149.88,52.53 | 148.75,79.59 149.81,80.65 -.8 -.10 155.73,80.65 158.76,78.38 v159.47,78.38 | +.8 +.10 | ].8 ].10 | v159.47,72.38 177.16,72.38 | 148.73,6.18 148.15,5.59 139.5,5.59 138.72,6.38 v135.47,6.38 | v130.47,6.38 125.44,6.38 123.51,4.44 117.47,4.44 116.43,5.49 116.43,8.41 116.43,13.33 | 116.43,13.33 116.43,19.18 | 116.43,19.18 116.43,24.2 | 116.43,24.2 116.43,30.19 | 116.43,30.19 116.43,35.21 | 116.43,35.21 116.43,40.23 | 116.43,40.23 116.43,46.26 | 116.43,46.26 116.43,51.43 | 116.43,51.43 116.43,57.28 | 116.43,57.28 116.43,62.33 | 116.43,62.33 116.43,67.14 | 116.43,67.14 116.43,70.26 | R62.1 116.43,13.33 | R54.1 118.31,19.18 116.43,19.18 | R53.1 118.33,24.2 116.43,24.2 | R40.1 118.33,30.19 116.43,30.19 | R39.1 118.35,35.21 116.43,35.21 | R27.1 118.37,40.23 116.43,40.23 | R26.1 118.4,46.26 116.43,46.26 | R14.1 116.53,51.33 116.43,51.43 | R29.1 116.48,57.33 116.43,57.28 | R17.1 116.43,62.33 | R16.1 116.62,67.33 116.43,67.14 | 148.73,35.9 148.73,36.37 ,.8 | 148.77,38.35 149.47,37.65 ,.8 | 148.72,21.83 148.72,22.37 -1.8 | -1.8 148.77,24.89 148.77,34.11 | 148.74,64.94 148.74,65.38 149.88,66.53 | 149.88,66.53 ..8 | 148.73,77.2 148.73,67.68 149.88,66.53 | 148.78,51.42 149.88,52.53 | 148.74,63.25 148.74,53.68 149.88,52.53
  Bottom 0.813: 116.43,70.26 113.98,72.71 75.88,72.71 73.28,70.1 73.28,70.08 73.14,69.94 68.58,69.94 | ..10 ..8 | +.10 175.89,80.65 177.16,79.38 177.16,72.38 177.16,66.65 | 177.16,66.65 177.16,52.65 | 177.16,52.65 177.16,37.65 | 177.16,37.65 177.16,23.18 | 177.16,23.18 177.16,11.27 ]1.10 ]1.8 | +1.8 +1.10 176.69,23.65 177.16,23.18 | 0.8 0.10 177.16,37.65 | _.8 _.10 177.16,52.65 | ].10 177.16,66.65 | 68.58,69.94 61.47,69.94 | 61.47,69.94 53.75,69.94 | 53.75,69.94 46.47,69.94 | 46.47,69.94 39.46,69.94 | 39.46,69.94 33.59,69.94 32.69,70.85 32.69,71.94 R15.1 | R28.1 39.53,70.02 39.46,69.94 | R41.1 46.49,69.96 46.47,69.94 | R38.1 53.75,69.94 | R52.1 61.47,69.94 | R61.1 68.5,70.02 68.58,69.94
  pour Bottom: 130.18,87.63 118.75,87.63 118.75,0 182.24,0 182.24,87.63
M1A
  Bottom 0.33: 98.3,54.37 99.77,54.37
  Bottom 0.508: 97.72,54.37 98.3,54.37 | 99.77,54.37 100.37,54.37
  Bottom 0.61: PCB1.22 97.72,54.37 | 100.37,54.37 107.63,61.63 107.63,62.26 R21.2
M1A'  (via drill 0.8 pad 1.27)
  Top 0.61: v131.72,60.51 124.59,60.51 v124.47,60.38 | v134.51,66.71 134.51,64.04 v134.43,63.96 | v155.95,74.34 146.51,74.34 v146.47,74.38
  Bottom 0.61: v124.47,60.38 124.19,60.11 OK4.3 | v134.51,66.71 134.51,76.4 136.21,78.11 -.1 146.12,74.38 v146.47,74.38 | v134.43,63.96 134.5,63.89 134.5,63.29 v131.72,60.51 | v155.95,74.34 157.44,74.34 161.22,78.11 +.1
  Bottom 1.016: R17.2 120.96,60.43 OK4.3
M1B
  Bottom 0.61: PCB1.23 100.09,55.64 105.73,61.28 105.73,64.45 107.63,66.36 107.63,68.26 R20.2
M1B'  (via drill 0.8 pad 1.27)
  Top 0.61: v132.86,66.67 124.76,66.67 v124.47,66.38 | v133.52,80.82 133.52,77.44 v133.47,77.38 | v158.47,84.38 v158.47,80.38
  Bottom 0.61: OK3.3 124.19,66.11 v124.47,66.38 | v133.47,77.38 132.86,76.78 v132.86,66.67 | v133.52,80.82 133.69,80.65 -.2 146.12,84.38 v158.47,84.38 | +.2 158.74,80.65 v158.47,80.38
  Bottom 1.016: OK3.3 120.59,65.43 R16.2
M2A
  Bottom 0.33: 98.3,51.85 98.32,51.82 99.77,51.82 99.79,51.85
  Bottom 0.406: 97.7,51.85 98.3,51.85 | 99.79,51.85 100.12,51.85
  Bottom 0.61: PCB1.24 97.7,51.85 | 100.12,51.85 106.98,51.85 R18.2
M2A'  (via drill 0.8 pad 1.27)
  Top 0.61: v131.47,49.38 v124.47,49.38 | v134.51,52.81 134.51,49.43 v134.47,49.38 | v155.61,60.2 155.57,60.17 146.57,60.17 v146.54,60.2
  Bottom 0.61: OK1.3 124.19,49.11 v124.47,49.38 | v134.47,49.38 v131.47,49.38 | v134.51,52.81 134.51,59.9 138.72,64.11 ..1 142.74,64.11 146.54,60.31 v146.54,60.2 | v155.61,60.2 155.61,61.94 157.77,64.11 ].1
  Bottom 1.016: OK1.3 120.96,49.43 R14.2
M2B
  Bottom 0.61: PCB1.25 103.24,53.1 R33.2
M2B'  (via drill 0.8 pad 1.27)
  Top 0.61: v131.72,55.42 124.65,55.42 v124.6,55.46 | v136.5,66.65 v136.5,64.02 | v155.75,72.4 146.49,72.4 v146.47,72.38
  Bottom 0.61: OK8.3 124.25,55.11 v124.6,55.46 | v131.72,55.42 133.35,57.05 133.35,60.64 136.5,63.79 v136.5,64.02 | v136.5,66.65 ..2 142.38,69.04 145.72,72.38 v146.47,72.38 | v155.75,72.4 155.75,68.72 157.82,66.65 ].2
  Bottom 1.016: R29.2 120.96,55.43 OK8.3
M3A
  Bottom 0.33: 97.97,49.3 99.64,49.3
  Bottom 0.508: 99.64,49.3 99.92,49.3
  Bottom 0.61: R31.2 107.52,41.71 99.92,49.3 | 97.97,49.3 96.71,50.56 PCB1.26
M3A'  (via drill 0.8 pad 1.27)
  Top 0.61: v131.47,38.38 v124.47,38.38 | v155.63,46.4 146.49,46.4 v146.47,46.38
  Bottom 0.61: v124.47,38.38 123.74,39.11 OK6.3 | v131.47,38.38 131.47,41.3 140.28,50.11 =.1 142.74,50.11 v146.47,46.38 | v155.63,46.4 155.63,48 157.74,50.11 _.1
  Bottom 0.813: OK6.3 120.59,38.43 R27.2
M3B
  Bottom 0.61: R30.2 104.12,46.38 99.94,50.56 PCB1.27
M3B'  (via drill 0.8 pad 1.27)
  Top 0.61: v132.47,44.38 v124.47,44.38 | v136.49,52.72 136.49,49.4 v136.47,49.38 | v155.58,58.7 155.55,58.68 v146.49,58.68
  Bottom 0.61: OK5.3 124.19,44.11 v124.47,44.38 | v132.47,44.38 136.47,48.38 v136.47,49.38 | v136.49,52.72 136.56,52.65 =.2 142.38,55.07 146.06,58.74 146.42,58.74 v146.49,58.68 | _.2 157.53,52.65 155.58,54.6 v155.58,58.7
  Bottom 0.813: R26.2 120.96,44.43 OK5.3
M4A
  Bottom 0.33: 98.3,46.76 99.61,46.76 100.49,45.87
  Bottom 0.508: 98.3,46.76 97.99,46.76
  Bottom 0.61: R44.2 107.52,30.6 104.46,33.66 104.46,41.91 100.49,45.87 | 97.99,46.76 96.73,48.02 PCB1.28
M4A'  (via drill 0.8 pad 1.27)
  Top 0.61: v124.47,28.38 124.51,28.33 130.42,28.33 v130.47,28.38 | v155.56,31.39 146.48,31.39 v146.47,31.38
  Bottom 0.61: v124.47,28.38 124.19,28.11 OK11.3 | v130.47,28.38 130.62,28.38 137.34,35.11 ,.1 142.74,35.11 v146.47,31.38 | v155.56,31.39 155.56,33 157.66,35.11 0.1
  Bottom 0.813: OK11.3 118.78,28.11 R40.2
M4B
  Bottom 0.61: R43.2 107.52,36 105.64,37.87 105.64,41.99 99.62,48.02 PCB1.29
M4B'  (via drill 0.8 pad 1.27)
  Top 0.61: v130.47,33.38 v124.47,33.38 | v134.5,37.57 v134.5,34.91 | v155.61,44.48 146.57,44.48 v146.47,44.38
  Bottom 0.61: v124.47,33.38 124.19,33.11 OK10.3 | v130.47,33.38 132.97,33.38 v134.5,34.91 | v134.5,37.57 134.58,37.65 ,.2 142.38,40.3 v146.47,44.38 | v155.61,44.48 155.61,39.97 157.93,37.65 0.2
  Bottom 0.813: R39.2 120.96,33.43 OK10.3
M5A
  Bottom 0.305: 102.6,38.8 99.71,41.69 97.7,41.69 PCB1.32
  Bottom 0.61: R58.2 107.52,19.8 102.6,24.71 102.6,38.8
M5A'  (via drill 0.8 pad 1.27)
  Top 0.61: v129.03,17.38 v124.47,17.38 | v155.61,17.36 146.49,17.36 v146.47,17.38
  Bottom 0.61: v124.47,17.38 124.19,17.11 OK16.3 | v129.03,17.38 129.03,20.12 130.01,21.11 -1.1 146.12,17.38 v146.47,17.38 | +1.1 157.95,21.11 155.51,18.66 155.51,17.46 v155.61,17.36
  Bottom 0.813: R54.2 120.96,17.43 OK16.3
M5B
  Bottom 0.61: PCB1.33 99.62,42.94 103.5,39.05 103.5,29.39 R57.2
M5B'  (via drill 0.8 pad 1.27)
  Top 0.61: v130.47,23.38 130.32,23.24 v124.69,23.24 | v155.56,29.9 146.51,29.9 v146.49,29.88
  Bottom 0.61: OK15.3 123.24,22.11 124.36,23.24 v124.69,23.24 | v130.47,23.38 130.77,23.38 131.04,23.65 -1.2 142.38,26.18 146.09,29.88 v146.49,29.88 | +1.2 157.64,23.65 155.56,25.74 v155.56,29.9
  Bottom 0.813: OK15.3 120.96,22.43 R53.2
M6A
  Bottom 0.305: 97.7,39.15 99.62,39.15 100.65,38.12 100.65,38.1
  Bottom 0.61: PCB1.34 97.7,39.15 | 100.65,38.1 100.65,16.96 R55.2
M6A'  (via drill 0.8 pad 1.27)
  Top 0.61: v159.47,3.38 159.2,3.12 v133.95,3.12
  Bottom 0.61: OK13.3 122.95,6.11 124.38,7.54 133.98,7.54 | v159.47,3.38 159.47,5.74 161.06,7.11 ]1.1 | v133.95,3.12 133.95,7.51 133.98,7.54 | 133.98,7.54 141.95,7.54 .1.1
  Bottom 0.813: R51.2 120.96,6.43 OK13.3
M6B
  Bottom 0.61: R64.2 107.52,14.72 101.66,20.58 101.66,38.4 99.66,40.4 PCB1.35
M6B'  (via drill 0.8 pad 1.27)
  Top 0.61: v129.27,11.39 124.48,11.39 v124.47,11.38 | v155.65,15.82 146.51,15.82 v146.44,15.88
  Bottom 0.61: v124.47,11.38 123.74,12.11 OK20.3 | v129.27,11.39 131.01,9.65 .1.2 142.38,12.84 145.42,15.88 v146.44,15.88 | ]1.2 157.99,9.65 155.65,11.99 v155.65,15.82
  Bottom 0.813: OK20.3 120.59,11.43 R62.2
N$1  (via drill 0.61, 0.75, 0.8)
  Top 0.61: v101.47,12.38 101.51,12.43 101.51,59.79 v101.49,59.8
  Top 0.813: v73.89,3.7 74.02,3.83 v74.02,11.95
  Bottom 0.61: v101.49,59.8 101.09,60.21 94.12,60.21 91.92,62.41 91.92,64.47 90.66,65.73 U$1.A1
  Bottom 0.813: RESET1.2 17.67,3.93 73.67,3.93 v73.89,3.7 | v101.47,12.38 101.38,12.29 101.38,11.95 v74.02,11.95
N$3
  Bottom 0.813: LED1.A 30.42,31.16 R1.1
N$4
  Bottom 0.813: LED2.A R2.1
N$6
  Bottom 0.813: IC1.1 15.15,38.34 C2.-
N$9
  Bottom 1.016: OK1.1 111.12,51.65 111.1,51.67 110.13,51.67 R18.1
N$10
  Bottom 0.61: R19.1 31.52,65.89 OK2.1
N$11
  Bottom 1.016: OK3.1 113.38,68.38 R20.1
N$12
  Bottom 1.016: OK4.1 113.38,62.38 R21.1
N$13  (via drill 0.61, 0.8)
  Top 0.61: v103.47,10.38 v103.47,61.38
  Top 0.813: v76.41,7.11 76.41,2.43 v76.47,2.38
  Bottom 0.61: v103.47,61.38 98.47,61.38 95.47,64.38 95.47,64.22 U$1.C2
  Bottom 0.813: RESET1.4 14.73,2.38 v76.47,2.38 | v103.47,10.38 100.19,7.11 v76.41,7.11
N$18
  Bottom 1.016: OK5.1 113.38,46.38 R30.1
N$19
  Bottom 1.016: OK6.1 113.38,41.38 R31.1
N$20
  Bottom 0.813: OK7.1 39.19,62.7 R32.1
N$21
  Bottom 1.016: OK8.1 113.38,57.38 R33.1
N$37
  Bottom 0.813: OK9.1 53.19,62.6 R42.1
N$38
  Bottom 1.016: OK10.1 113.38,35.38 R43.1
N$39
  Bottom 1.016: OK11.1 113.38,30.38 R44.1
N$40
  Bottom 0.813: OK12.1 46.19,62.7 R45.1
N$43
  Bottom 1.016: OK13.1 112.31,9.99 R55.1
N$44
  Bottom 0.813: OK14.1 61.19,62.6 R56.1
N$45
  Bottom 1.016: OK15.1 112.93,25.38 R57.1
N$46
  Bottom 1.016: OK16.1 113.38,19.38 R58.1
N$50
  Bottom 0.813: OK19.1 68.19,62.6 R63.1
N$51
  Bottom 1.016: OK20.1 113.38,14.38 R64.1
PITCH
  Bottom 0.61: SV2.3 54.26,25.92 55.11,25.38 96.35,25.38 PCB1.46
PWM1
  Bottom 0.813: R19.2 33.42,62.15 35.24,60.32 40,60.32 41.59,58.74 41.59,58.19 PCB1.9
PWM1'  (via drill 0.8 pad 1.27)
  Top 0.61: v36.47,85.38 v36.47,74.38
  Bottom 0.33: 141.54,79.38 143.25,79.38
  Bottom 0.51: 124.77,79.38 141.54,79.38 | 143.25,79.38 144.46,79.38
  Bottom 0.61: v36.47,85.38 36.71,85.62 118.53,85.62 124.77,79.38 | 144.93,78.91 -.4 147.14,82.87 168.59,82.87 170.47,80.99 +.6 | 144.93,78.91 -.3 | 144.46,79.38 144.93,78.91 | v36.47,74.38 36.28,74.19 OK2.3 34.46,73.92 R15.2
PWM2
  Bottom 0.813: R32.2 41.76,62.38 44.13,60.01 44.13,58.19 PCB1.8
PWM2'  (via drill 0.8 pad 1.27)
  Top 0.61: v43.47,84.38 v43.47,74.38 | v158.99,70.64 158.78,70.43 146.51,70.43 v146.47,70.38
  Bottom 0.33: 143.36,65.41 143.33,65.37 141.61,65.37 141.58,65.41
  Bottom 0.51: 141.58,65.41 135.81,65.41 | 132.4,65.41 135.81,65.41 | 144.93,65.41 143.36,65.41 | 135.81,65.41
  Bottom 0.61: ..3 144.93,65.41 ..4 144.93,68.84 v146.47,70.38 | R28.2 41.74,72.5 OK7.3 43.28,74.19 v43.47,74.38 | v43.47,84.38 43.49,84.38 43.72,84.61 117.95,84.61 131.44,71.12 131.44,66.36 132.4,65.41 | v158.99,70.64 166.48,70.64 ].6
PWM3
  Bottom 0.813: R45.2 48.41,60.8 48.18,60.57 PCB1.7
PWM3'  (via drill 0.8 pad 1.27)
  Top 0.61: v51.47,83.38 51.3,83.21 v51.3,74.28 | v159.14,57.09 146.64,57.09 v146.55,57
  Bottom 0.33: 141.31,51.44 141.38,51.37 143.3,51.37 143.36,51.44
  Bottom 0.51: 132.08,51.44 141.31,51.44 | 143.36,51.44 144.93,51.44
  Bottom 0.61: =.3 144.93,51.44 =.4 144.93,55.37 v146.55,57 | R41.2 48.74,72.53 OK12.3 51.26,74.19 51.3,74.23 v51.3,74.28 | v51.47,83.38 51.66,83.57 117.72,83.57 130.49,70.8 130.49,53.02 132.08,51.44 | v159.14,57.09 165.03,57.09 _.6
PWM4
  Bottom 0.813: R42.2 51.75,62.38 51.75,60.96 50.73,59.25 PCB1.6
PWM4'  (via drill 0.8 pad 1.27)
  Top 0.61: v58.47,82.23 v58.47,74.38 | v158.47,42.38 v146.47,42.38
  Bottom 0.33: 141.52,36.38 143.01,36.38
  Bottom 0.51: 130.94,36.38 141.52,36.38 | 143.01,36.38 144.91,36.38
  Bottom 0.61: 144.93,36.37 ,.4 144.93,40.79 146.47,42.33 v146.47,42.38 | 144.93,36.37 ,.3 | R38.2 55.74,72.09 OK9.3 58.28,74.19 v58.47,74.38 | v58.47,82.23 58.75,82.51 117.51,82.51 129.54,70.48 129.54,37.78 130.94,36.38 | 144.91,36.38 144.93,36.37 | 0.6 164.74,42.38 v158.47,42.38
PWM5
  Bottom 0.813: R56.2 59.52,62.55 58.1,62.55 53.27,58.35 PCB1.5
PWM5'  (via drill 0.8 pad 1.27)
  Top 0.61: v65.47,80.38 v65.47,74.38 | v158.47,28.38 v146.47,28.38
  Bottom 0.34: 141.2,22.37 143.51,22.37
  Bottom 0.51: 129.77,22.24 141.07,22.24 141.2,22.37 | 143.51,22.37 144.93,22.37
  Bottom 0.61: -1.3 144.93,22.37 -1.4 144.93,26.84 v146.47,28.38 | R52.2 63.74,72.54 OK14.3 65.28,74.19 v65.47,74.38 | v65.47,80.38 65.47,80.66 66.27,81.47 117.28,81.47 128.59,70.17 128.59,23.42 129.77,22.24 | +1.6 165.74,28.38 v158.47,28.38
PWM6
  Bottom 0.813: R63.2 66.52,61.73 64.45,60.01 57.47,60.01 55.81,58.68 PCB1.4
PWM6'  (via drill 0.8 pad 1.27)
  Top 0.61: v72.47,79.38 v72.47,74.38 | v158.47,14.38 v146.47,14.38
  Bottom 0.33: 143.12,8.39 141.53,8.39
  Bottom 0.51: 141.53,8.39 129.09,8.39 | 144.74,8.39 143.12,8.39
  Bottom 0.61: .1.3 144.93,8.57 | 144.93,8.57 .1.4 144.93,12.84 v146.47,14.38 | R61.2 70.74,72.52 OK19.3 72.28,74.19 v72.47,74.38 | v72.47,79.38 118.1,79.38 127.63,69.85 127.63,9.84 129.09,8.39 | 144.74,8.39 144.93,8.57 | ]1.6 169.35,9.65 169.86,10.16 165.64,14.38 v158.47,14.38
ROLL
  Bottom 0.305: 97.71,26.43 96.93,26.43 94.79,26.43
  Bottom 0.508: PCB1.45 97.71,26.43 | 94.79,26.43 94.6,26.58
  Bottom 0.61: SV2.2 54.56,28.46 56.78,26.58 94.6,26.58
RST
  Bottom 0.61: RESET.3 19.98,23.89
  Bottom 0.813: 19.98,23.89 RESET.4 25.73,5.38 34.47,5.38 36.47,7.38 36.47,8.94 PCB1.RESET | RESET.3 15.22,23.63 12.47,26.38 12.47,38.38 14.68,40.59 19.25,40.59 JP3.1
RX
  Bottom 0.813: UART1.1 84.28,62.41 | 83.19,62.23 83.82,62.87 84.28,62.41 | PCB1.17 82.72,62.23 83.19,62.23 | U$1.A2 90.66,63.35 89.53,62.23 84.46,62.23 | 84.46,62.23 83.19,62.23 | 84.28,62.41 84.46,62.23
SCL
  Bottom 0.61: I2C.1 22.2,61.57 21.27,60.64 21.27,58.19 PCB1.SCL1
SDA
  Bottom 0.61: PCB1.SDA1 24.21,58.18 26.03,60.01 26.03,63.18 25.11,64.11 I2C.2
SERVO
  Bottom 0.61: JP1.2 95.16,16.26 PCB1.52
TRIG1
  Bottom 0.61: SU1.3 86.74,36.11 87.47,35.31 90.47,35.31 92.94,37.86 PCB1.36
TRIG2
  Bottom 0.508: PCB1.38 96.44,34.95 96.47,34.93 | 93.9,34.84 94.01,34.93
  Bottom 0.61: SU2.3 75.74,36.71 78.76,33.71 92.74,33.71 93.9,34.84 | 94.01,34.93 96.47,34.93
TRIG3
  Bottom 0.61: SU3.3 70.24,31.88 94.18,31.88 95.08,32.78 PCB1.40
TRIG4
  Bottom 0.61: SU4.3 61.24,29.88 61.72,29.88 61.74,29.88 96.09,29.88 PCB1.42
TRO
  Bottom 0.508: 96.46,27.78 PCB1.44
  Bottom 0.61: SV2.1 54.96,31 58.59,27.78 96.46,27.78
TX
  Bottom 0.813: PCB1.16 81.74,63.79 UART1.2 81.74,67.13 83.19,68.58 96.19,68.58 U$1.D1
YAW
  Bottom 0.305: 97.42,23.88 95.34,23.88 95.26,23.97
  Bottom 0.508: SV2.4 47.36,23.98 | PCB1.47 98.81,25.16 97.42,23.88
  Bottom 0.61: 95.26,23.97 95.12,23.97 94.53,23.98 47.36,23.98